# Altium schematic sheet FPGA_REG.SchDoc
size A4; SheetNumber: 12; SheetTotal: 14
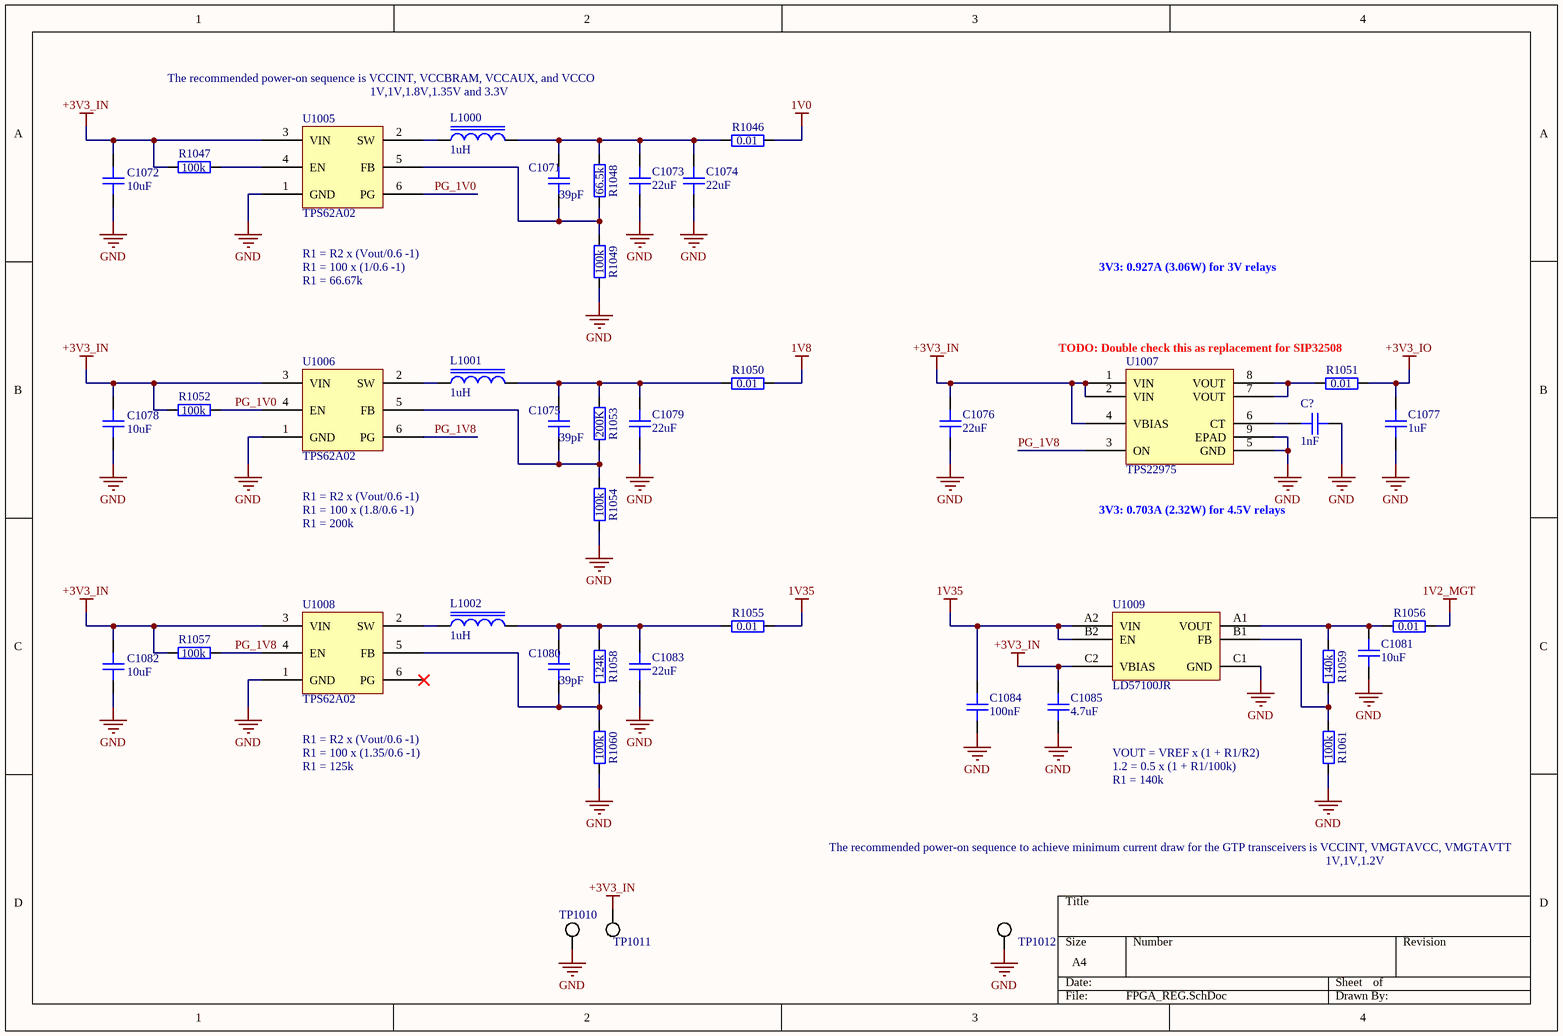
[diagram p0: FPGA_REG.SchDoc]

## Parts
C1071  39pF  [GEN_C_0402]
C1072  10uF  [GEN_C_0603]
C1073  22uF  [GEN_C_0805]
C1074  22uF  [GEN_C_0805]
C1075  39pF  [GEN_C_0402]
C1076  22uF  [GEN_C_0805]
C1077  1uF  [GEN_C_0402]
C1078  10uF  [GEN_C_0603]
C1079  22uF  [GEN_C_0805]
C1080  39pF  [GEN_C_0402]
C1081  10uF  [GEN_C_0603]
C1082  10uF  [GEN_C_0603]
C1083  22uF  [GEN_C_0805]
C1084  100nF  [GEN_C_0402]
C1085  4.7uF  [GEN_C_0402]
C?  1nF  [GEN_C_0402]
L1000  1uH  [GEN_L_1210]
L1001  1uH  [GEN_L_1210]
L1002  1uH  [GEN_L_1210]
R1046  0.01  [GEN_R_0603]
R1047  100k  [GEN_R_0402]
R1048  66.5k  [GEN_R_0402]
R1049  100k  [GEN_R_0402]
R1050  0.01  [GEN_R_0603]
R1051  0.01  [GEN_R_0603]
R1052  100k  [GEN_R_0402]
R1053  200K  [GEN_R_0402]
R1054  100k  [GEN_R_0402]
R1055  0.01  [GEN_R_0603]
R1056  0.01  [GEN_R_0603]
R1057  100k  [GEN_R_0402]
R1058  124k  [GEN_R_0402]
R1059  140k  [GEN_R_0402]
R1060  100k  [GEN_R_0402]
R1061  100k  [GEN_R_0402]
TP1010  PCB  [GEN_TP_PCB]  (value not drawn)  (no BOM)
TP1011  PCB  [GEN_TP_PCB]  (value not drawn)  (no BOM)
TP1012  PCB  [GEN_TP_PCB]  (value not drawn)  (no BOM)
U1005  TPS62A02  [TI_SOT563_DRL0006A]
U1006  TPS62A02  [TI_SOT563_DRL0006A]
U1007  TPS22975  [TI_WSON8_DSG0008A]
U1008  TPS62A02  [TI_SOT563_DRL0006A]
U1009  LD57100JR  [ST_FlipChip6]

## Nets
1V0: R1046.2
1V2_MGT: R1056.2
1V8: R1050.2
1V35: C1084.2 R1055.2 U1009.A2(VIN) U1009.B2(EN)
+3V3_IN: C1072.2 C1076.2 C1078.2 C1082.2 C1085.2 R1047.2 R1052.2 R1057.2 TP1011.1 U1005.3(VIN) U1006.3(VIN) U1007.1(VIN) U1007.2(VIN) U1007.4(VBIAS) U1008.3(VIN) U1009.C2(VBIAS)
+3V3_IO: C1077.2 R1051.2
GND: C1072.1 C1073.1 C1074.1 C1076.1 C1077.1 C1078.1 C1079.1 C1081.1 C1082.1 C1083.1 C1084.1 C1085.1 C?.1 R1049.1 R1054.1 R1060.1 R1061.1 TP1010.1 TP1012.1 U1005.1(GND) U1006.1(GND) U1007.5(GND) U1007.9(EPAD) U1008.1(GND) U1009.C1(GND)
PG_1V0: R1052.1 U1005.6(PG) U1006.4(EN)
PG_1V8: R1057.1 U1006.6(PG) U1007.3(ON) U1008.4(EN)
NetC1071_1: C1071.1 R1048.1 R1049.2 U1005.5(FB)
NetC1071_2: C1071.2 C1073.2 C1074.2 L1000.2 R1046.1 R1048.2
NetC1075_1: C1075.1 R1053.1 R1054.2 U1006.5(FB)
NetC1075_2: C1075.2 C1079.2 L1001.2 R1050.1 R1053.2
NetC1080_1: C1080.1 R1058.1 R1060.2 U1008.5(FB)
NetC1080_2: C1080.2 C1083.2 L1002.2 R1055.1 R1058.2
NetC1081_2: C1081.2 R1056.1 R1059.2 U1009.A1(VOUT)
NetC?_2: C?.2 U1007.6(CT)
NetL1000_1: L1000.1 U1005.2(SW)
NetL1001_1: L1001.1 U1006.2(SW)
NetL1002_1: L1002.1 U1008.2(SW)
NetR1047_1: R1047.1 U1005.4(EN)
NetR1051_1: R1051.1 U1007.7(VOUT) U1007.8(VOUT)
NetR1059_1: R1059.1 R1061.2 U1009.B1(FB)

Not connected (* = marked no-connect by the designer): U1008 6(PG)*

## Notes on the sheet
- The recommended power-on sequence is VCCINT, VCCBRAM, VCCAUX, and VCCO
- 1V,1V,1.8V,1.35V and 3.3V
- R1 = R2 x (Vout/0.6 -1)
- R1 = 100 x (1/0.6 -1)
- R1 = 66.67k
- 3V3: 0.927A (3.06W) for 3V relays
- TODO: Double check this as replacement for SIP32508
- R1 = 100 x (1.8/0.6 -1)
- 3V3: 0.703A (2.32W) for 4.5V relays
- R1 = 200k
- R1 = 100 x (1.35/0.6 -1)
- R1 = 125k
- VOUT = VREF x (1 + R1/R2)
- 1.2 = 0.5 x (1 + R1/100k)
- R1 = 140k
- The recommended power-on sequence to achieve minimum current draw for the GTP transceivers is VCCINT, VMGTAVCC, VMGTAVTT
- 1V,1V,1.2V

## Library data of the parts
C1071 C1075 C1080 = CAP 39pF 50V C0G 0402: House Part Number: C-39pF-0402-002; Manufacturer: KEMET; Manufacturer Part Number: C0402C390J5GACTU; Temperature Coefficient: C0G; Voltage Rating: 50V; Package: 0402; Value: 39pF; Supplier 1: Mouser; Supplier Part Number 1: 80-C0402C390J5G
C1072 C1078 C1081 C1082 = CAP 10uF 10V X5R 0603: House Part Number: C-10uF-0603-002; Manufacturer: Murata; Manufacturer Part Number: GRM188R61A106ME69D; Voltage Rating: 10V; Package: 0402; Supplier 1: Mouser; Supplier Part Number 1: 81-GRM188R61A106ME9D; Value: 10uF
C1073 C1074 C1076 C1079 C1083 = CAP 22uF 25V X5R 0805: House Part Number: C-22uF-0805-002; Manufacturer: Murata; Manufacturer Part Number: GRM21BR61E226ME44L; Voltage Rating: 25V; Package: 0805; Value: 22uF; Supplier 1: Mouser; Supplier Part Number 1: 81-GRM21BR61E226ME4L
C1077 = CAP 1uF 25V X5R 0402: Manufacturer: Murata; Manufacturer Part Number: GRM155R61E105KA12D; Voltage Rating: 25V; Package: 0402; Value: 1uF; Supplier 1: Mouser; Supplier Part Number 1: 81-GRM155R61E105KA2D
C1084 = CAP 100nF 16V X7R 0402: House Part Number: C-100nF-0402-002; Manufacturer: Murata; Manufacturer Part Number: GCM155R71C104KA55D; Voltage Rating: 16V; Package: 0402; Supplier 1: Mouser; Supplier Part Number 1: 81-GCM155R71C104KA5D; Value: 100nF
C1085 = CAP 4.7uF 6.3V X5R 0402: House Part Number: C-4.7uF-0402-002; Manufacturer: Murata; Manufacturer Part Number: GRM155R60J475ME47D; Voltage Rating: 6.3V; Package: 0402; Value: 4.7uF; Supplier 1: Mouser; Supplier Part Number 1: 81-GRM155R60J475ME7D
C? = CAP 1nF 50V C0G 0402: Manufacturer: Murata; Manufacturer Part Number: GRM1555C1H102FA01D; Voltage Rating: 50V; Package: 0402; Supplier 1: Mouser; Supplier Part Number 1: 81-GRM1555C1H102FA1D; Value: 1nF
L1000-L1002 = IND 1uH 5.5A 32 MOHM 1210: House Part Number: SRP3212-1R0M; Manufacturer: Bourns; Value: 1uH; Supplier 1: Mouser; Supplier Part Number 1: 652-SRP3212-1R0M; Manufacturer Part Number: SRP3212-1R0M
R1046 R1050 R1051 R1055 R1056 = RES 0.01 OHM 1% 1/4W 0603: House Part Number: R-0.01-0603-1%-001; Manufacturer: Susumu; Manufacturer Part Number: RL0816T-R010-F; Tolerance: 1%; Supplier 1: Mouser; Supplier Part Number 1: 754-RL0816T-R010-F; Value: 0.01; Package: 0603
R1047 R1049 R1052 R1054 R1057 R1060 R1061 = RES 100K OHM 1% 1/10W 0402: House Part Number: R-100K-0402-1%-001; Manufacturer: Yageo; Manufacturer Part Number: RC0402FR-07100KL; Tolerance: 1%; Package: 0402; Value: 100k; Supplier 1: Mouser; Supplier Part Number 1: 603-RC0402FR-07100KL
R1048 = RES 66.5K OHM 1% 1/16W 0402: House Part Number: R-66.5K-0402-1%-001; Manufacturer: Yageo; Manufacturer Part Number: RC0402FR-0766K5L; Tolerance: 1%; Package: 0402; Value: 66.5k; Supplier 1: Mouser; Supplier Part Number 1: 603-RC0402FR-0766K5L
R1053 = RES 200K OHM 1% 1/16W 0402: House Part Number: R-200K-0402-1%-001; Manufacturer: Yageo; Manufacturer Part Number: RC0402FR-07200KL; Tolerance: 1%; Package: 0402; Value: 200K; Supplier 1: Mouser; Supplier Part Number 1: 603-RC0402FR-07200KL
R1058 = RES 124K OHM 1% 1/10W 0402: House Part Number: R-124K-0402-1%-001; Manufacturer: Yageo; Manufacturer Part Number: RC0402FR-07124KL; Tolerance: 1%; Package: 0402; Value: 124k; Supplier 1: Mouser; Supplier Part Number 1: 603-RC0402FR-07124KL
R1059 = RES 140K OHM 1% 1/10W 0402: House Part Number: R-140K-0402-1%-001; Manufacturer: Yageo; Manufacturer Part Number: RC0402FR-07140KL; Tolerance: 1%; Package: 0402; Value: 140k; Supplier 1: Mouser; Supplier Part Number 1: 603-RC0402FR-07140KL
TP1010-TP1012 = TP PCB 1mm
U1005 U1006 U1008 = IC BUCK TPS62A02: House Part Number: TPS62A02DRLR; Manufacturer: Texas Instruments; Supplier 1: Texas Instruments; Supplier Part Number 1: TPS62A02DRLR; Manufacturer Part Number: TPS62A02DRLR
U1007 = IC SWITCH LOAD TPS22975: Manufacturer: Texas Instruments; Manufacturer Part Number: TPS22975DSGR; Supplier 1: Texas Instruments; Supplier Part Number 1: TPS22975DSGR
U1009 = IC LDO LD57100JR: Manufacturer: STMicroelectronics; Supplier 1: Mouser; Supplier Part Number 1: 511-LD57100JR; House Part Number: LD57100JR; Manufacturer Part Number: LD57100JR